# Altium schematic sheet A5000_8MB_RAMs.SchDoc: ARM2 to ARM3 Adapter
size A3; DocumentNumber: 1; SheetNumber: 3; SheetTotal: 5
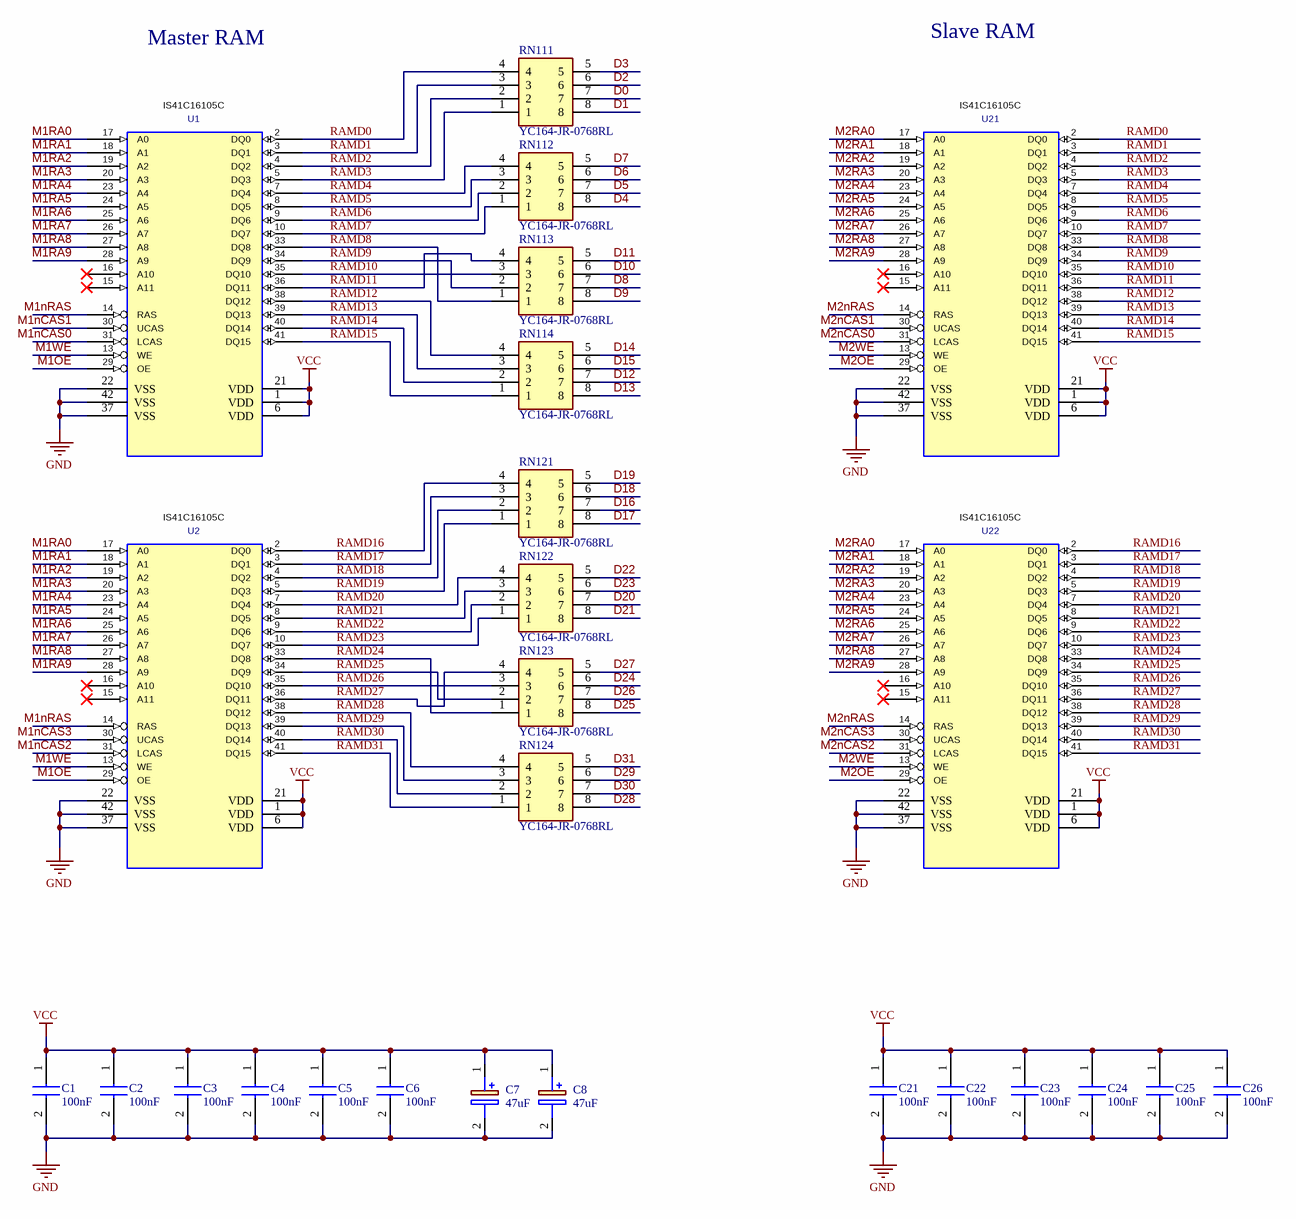
[diagram p0: A5000_8MB_RAMs.SchDoc]

## Parts
C1  100nF  [0805cap]
C2  100nF  [0805cap]
C3  100nF  [0805cap]
C4  100nF  [0805cap]
C5  100nF  [0805cap]
C6  100nF  [0805cap]
C7  47uF  [EEE1AA101SP]
C8  47uF  [EEE1AA101SP]
C21  100nF  [0805cap]
C22  100nF  [0805cap]
C23  100nF  [0805cap]
C24  100nF  [0805cap]
C25  100nF  [0805cap]
C26  100nF  [0805cap]
RN111  YC164-JR-0768RL  [YC164JR0768RL]
RN112  YC164-JR-0768RL  [YC164JR0768RL]
RN113  YC164-JR-0768RL  [YC164JR0768RL]
RN114  YC164-JR-0768RL  [YC164JR0768RL]
RN121  YC164-JR-0768RL  [YC164JR0768RL]
RN122  YC164-JR-0768RL  [YC164JR0768RL]
RN123  YC164-JR-0768RL  [YC164JR0768RL]
RN124  YC164-JR-0768RL  [YC164JR0768RL]
U1  IS41C16105C  [SOJ-42]
U2  IS41C16105C  [SOJ-42]
U21  IS41C16105C  [SOJ-42]
U22  IS41C16105C  [SOJ-42]

## Nets
GND: C1.2 C2.2 C3.2 C4.2 C5.2 C6.2 C7.2(-) C8.2(-) C21.2 C22.2 C23.2 C24.2 C25.2 C26.2 U1.22(VSS) U1.37(VSS) U1.42(VSS) U2.22(VSS) U2.37(VSS) U2.42(VSS) U21.22(VSS) U21.37(VSS) U21.42(VSS) U22.22(VSS) U22.37(VSS) U22.42(VSS)
VCC: C1.1 C2.1 C3.1 C4.1 C5.1 C6.1 C7.1(+) C8.1(+) C21.1 C22.1 C23.1 C24.1 C25.1 C26.1 U1.1(VCC) U1.6(VCC) U1.21(VCC) U2.1(VCC) U2.6(VCC) U2.21(VCC) U21.1(VCC) U21.6(VCC) U21.21(VCC) U22.1(VCC) U22.6(VCC) U22.21(VCC)
D0: RN111.7
D1: RN111.8
D2: RN111.6
D3: RN111.5
D4: RN112.8
D5: RN112.7
D6: RN112.6
D7: RN112.5
D8: RN113.7
D9: RN113.8
D10: RN113.6
D11: RN113.5
D12: RN114.7
D13: RN114.8
D14: RN114.5
D15: RN114.6
D16: RN121.7
D17: RN121.8
D18: RN121.6
D19: RN121.5
D20: RN122.7
D21: RN122.8
D22: RN122.5
D23: RN122.6
D24: RN123.6
D25: RN123.8
D26: RN123.7
D27: RN123.5
D28: RN124.8
D29: RN124.6
D30: RN124.7
D31: RN124.5
M1nCAS0: U1.31(LCAS)
M1nCAS1: U1.30(UCAS)
M1nCAS2: U2.31(LCAS)
M1nCAS3: U2.30(UCAS)
M1nRAS: U1.14(RAS) U2.14(RAS)
M1OE: U1.29(OE) U2.29(OE)
M1RA0: U1.17(A0) U2.17(A0)
M1RA1: U1.18(A1) U2.18(A1)
M1RA2: U1.19(A2) U2.19(A2)
M1RA3: U1.20(A3) U2.20(A3)
M1RA4: U1.23(A4) U2.23(A4)
M1RA5: U1.24(A5) U2.24(A5)
M1RA6: U1.25(A6) U2.25(A6)
M1RA7: U1.26(A7) U2.26(A7)
M1RA8: U1.27(A8) U2.27(A8)
M1RA9: U1.28(A9) U2.28(A9)
M1WE: U1.13(WE) U2.13(WE)
M2nCAS0: U21.31(LCAS)
M2nCAS1: U21.30(UCAS)
M2nCAS2: U22.31(LCAS)
M2nCAS3: U22.30(UCAS)
M2nRAS: U21.14(RAS) U22.14(RAS)
M2OE: U21.29(OE) U22.29(OE)
M2RA0: U21.17(A0) U22.17(A0)
M2RA1: U21.18(A1) U22.18(A1)
M2RA2: U21.19(A2) U22.19(A2)
M2RA3: U21.20(A3) U22.20(A3)
M2RA4: U21.23(A4) U22.23(A4)
M2RA5: U21.24(A5) U22.24(A5)
M2RA6: U21.25(A6) U22.25(A6)
M2RA7: U21.26(A7) U22.26(A7)
M2RA8: U21.27(A8) U22.27(A8)
M2RA9: U21.28(A9) U22.28(A9)
M2WE: U21.13(WE) U22.13(WE)
RAMD0: RN111.4 U1.2(DQ0) U21.2(DQ0)
RAMD1: RN111.3 U1.3(DQ1) U21.3(DQ1)
RAMD2: RN111.2 U1.4(DQ2) U21.4(DQ2)
RAMD3: RN111.1 U1.5(DQ3) U21.5(DQ3)
RAMD4: RN112.4 U1.7(DQ4) U21.7(DQ4)
RAMD5: RN112.3 U1.8(DQ5) U21.8(DQ5)
RAMD6: RN112.2 U1.9(DQ6) U21.9(DQ6)
RAMD7: RN112.1 U1.10(DQ7) U21.10(DQ7)
RAMD8: RN113.1 U1.33(DQ8) U21.33(DQ8)
RAMD9: RN113.2 U1.34(DQ9) U21.34(DQ9)
RAMD10: RN113.3 U1.35(DQ10) U21.35(DQ10)
RAMD11: RN113.4 U1.36(DQ11) U21.36(DQ11)
RAMD12: RN114.4 U1.38(DQ12) U21.38(DQ12)
RAMD13: RN114.3 U1.39(DQ13) U21.39(DQ13)
RAMD14: RN114.2 U1.40(DQ14) U21.40(DQ14)
RAMD15: RN114.1 U1.41(DQ15) U21.41(DQ15)
RAMD16: RN121.4 U2.2(DQ0) U22.2(DQ0)
RAMD17: RN121.3 U2.3(DQ1) U22.3(DQ1)
RAMD18: RN121.2 U2.4(DQ2) U22.4(DQ2)
RAMD19: RN121.1 U2.5(DQ3) U22.5(DQ3)
RAMD20: RN122.4 U2.7(DQ4) U22.7(DQ4)
RAMD21: RN122.3 U2.8(DQ5) U22.8(DQ5)
RAMD22: RN122.2 U2.9(DQ6) U22.9(DQ6)
RAMD23: RN122.1 U2.10(DQ7) U22.10(DQ7)
RAMD24: RN123.1 U2.33(DQ8) U22.33(DQ8)
RAMD25: RN123.2 U2.34(DQ9) U22.34(DQ9)
RAMD26: RN123.3 U2.35(DQ10) U22.35(DQ10)
RAMD27: RN123.4 U2.36(DQ11) U22.36(DQ11)
RAMD28: RN124.4 U2.38(DQ12) U22.38(DQ12)
RAMD29: RN124.3 U2.39(DQ13) U22.39(DQ13)
RAMD30: RN124.2 U2.40(DQ14) U22.40(DQ14)
RAMD31: RN124.1 U2.41(DQ15) U22.41(DQ15)

Not connected (* = marked no-connect by the designer): U1 15(A11)* 16(A10)*; U2 15(A11)* 16(A10)*; U21 15(A11)* 16(A10)*; U22 15(A11)* 16(A10)*

## Notes on the sheet
- Master RAM
- Slave RAM
- SIZE
- CODION LTD
- DIMENSIONS
- TITLE
- VARIANT
- REVISION
- DATE
- A3
- SHEET
- OF
- FILE
- DRAWN BY

## Library data of the parts
C1-C6 C21-C26 = 100nF0805: Capacitor; Manufacturer_Name: TDK; Manufacturer_Part_Number: C2012X7R1H104K125AM; Datasheet Link: https://product.tdk.com/info/en/catalog/datasheets/mlcc_commercial_midvoltage_en.pdf; Height: 1.45mm; Mouser Part Number: 810-C2012X7R1H104KT5; Mouser Price/Stock: https://www.mouser.com/Search/Refine.aspx?Keyword=810-C2012X7R1H104KT5; Arrow Part Number: C2012X7R1H104K125AM; Arrow Price/Stock: https://www.arrow.com/en/products/c2012x7r1h104k125am/tdk; LCSC Part #: C111492
C7 C8 = EEE1VA470WP: Capacitor Polarised; Manufacturer_Name: Panasonic; Datasheet Link: http://industrial.panasonic.com/cdbs/www-data/pdf/RDE0000/ABA0000C1145.pdf; Height: 7.8mm; Manufacturer_Part_Number: EEE1VA470WP
RN111-RN114 RN121-RN124 = YC164-JR-0768RL: Resistor Network; Manufacturer_Name: KEMET; Datasheet Link: https://www.yageo.com/upload/media/product/productsearch/datasheet/rchip/PYu-YC_TC_group_51_RoHS_L_9.pdf; Height: 0.7mm; Manufacturer_Part_Number: YC164-JR-0768RL; Mouser Part Number: 603-YC164-JR-0768RL; Mouser Price/Stock: https://www.mouser.co.uk/ProductDetail/Yageo/YC164-JR-0768RL?qs=8cPjvKtxWv7AOp%2F0jDxI3w%3D%3D; Arrow Part Number: YC164-JR-0768RL; Arrow Price/Stock: https://www.arrow.com/en/products/yc164-jr-0768rl/yageo; LCSC Part #: C695188
U1 U2 U21 U22 = DRAM_1MX16_SOJ: Value: IS41C16105C